# EAGLE schematic piezo-preamp-tickler_V1-01a_two_buffers (EAGLE 8.1.0)

## Sheet 1 of 2
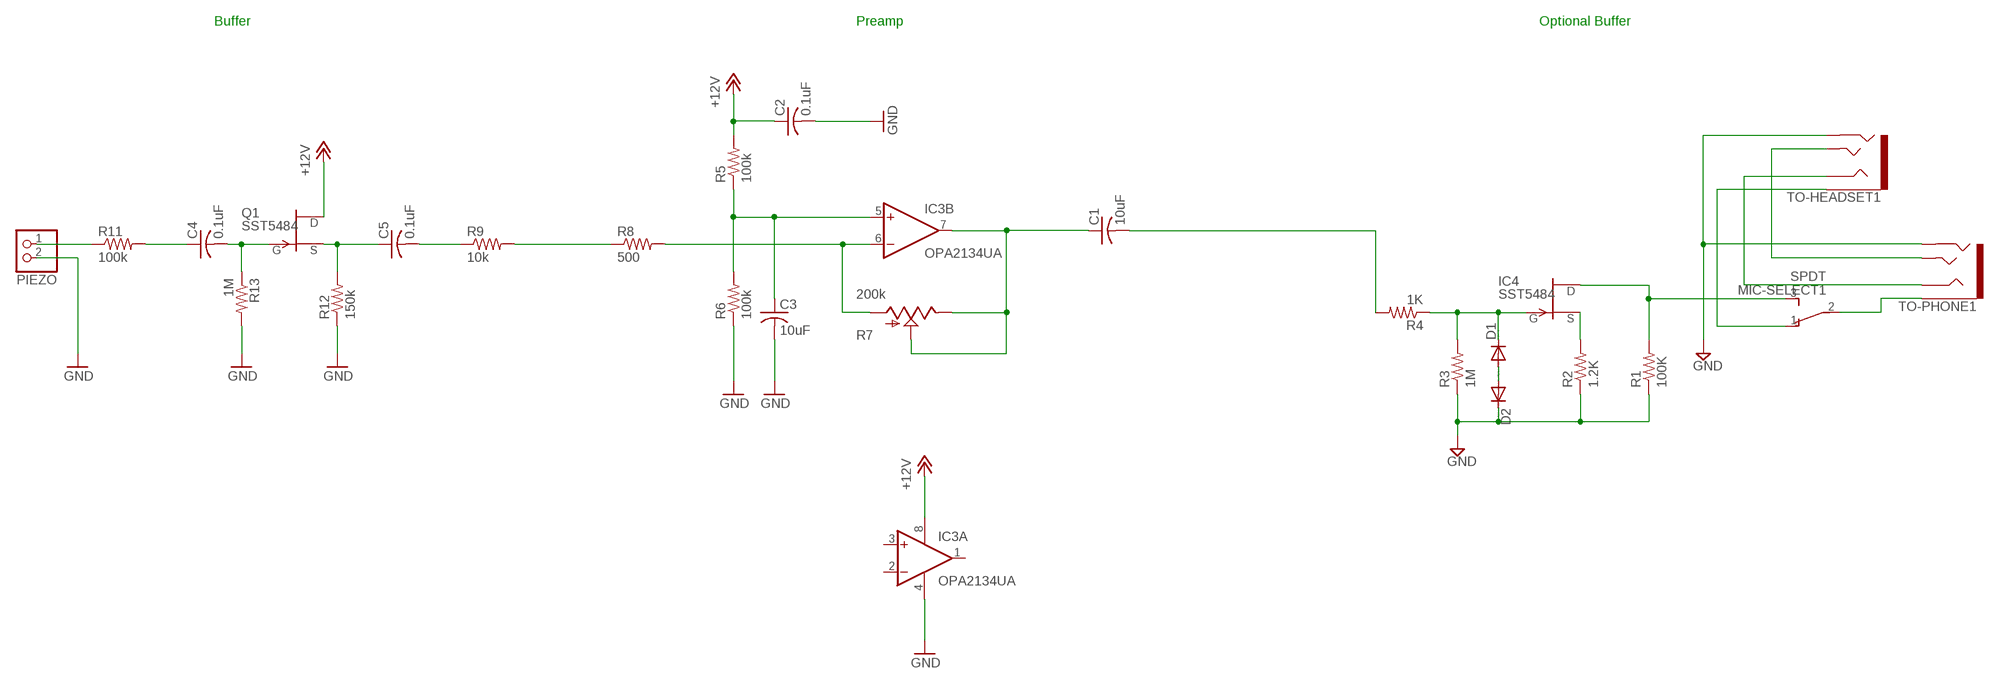
[diagram p0: schematic, sheet 1]

### Parts
C1  10uF  C-USC0805  [C0805]
C2  0.1uF  C-USC0805  [C0805]
C3  10uF  C-USC0805  [C0805]
C4  0.1uF  C-USC0805  [C0805]
C5  0.1uF  C-USC0805  [C0805]
D1  DIODE-SOD123  [SOD123]
D2  DIODE-SOD123  [SOD123]
IC3  OPA2134UA  [SO08]
IC4  SST5484  [SOT23]
MIC-SELECT1  SPDT  SWITCH_SPDTTE-CONNECT  [SWITCH_SPDT-TE-CONNECT]
PIEZO  JST_2PIN-THM  [JST-PH-2-THM]
Q1  SST5484  [SOT23]
R1  100K  R-US_R0603  [R0603]
R2  1.2K  R-US_R0603  [R0603]
R3  1M  R-US_R0603  [R0603]
R4  1K  R-US_R0603  [R0603]
R5  100k  R-US_R0603  [R0603]
R6  100k  R-US_R0603  [R0603]
R7  200k  TRIMPOT-BOURNS3306W  [TRIMPOT-BOURNS-3306W]
R8  500  R-US_R0603  [R0603]
R9  10k  R-US_R0603  [R0603]
R11  100k  R-US_R0603  [R0603]
R12  150k  R-US_R0603  [R0603]
R13  1M  R-US_R0603  [R0603]
TO-HEADSET1  AUDIO-JACK3LGPADS  [AUDIO-JACK-TRRS-SMD]
TO-PHONE1  AUDIO-JACK3LGPADS  [AUDIO-JACK-TRRS-SMD]

### Nets
+12V: C2.1 IC3.8(A:V+) Q1.1(D) R5.2 ; also sheet 2
BUFFER: C5.2 R9.1
GND: C2.2 C3.2 D2.C IC3.4(A:V-) PIEZO.2 R1.1 R2.1 R3.1 R6.1 R12.1 R13.2 TO-HEADSET1.RING2 TO-PHONE1.RING2 ; also sheet 2
N$1: IC4.1(D) MIC-SELECT1.3 R1.2
N$2: PIEZO.1 R11.1
N$3: C1.1 IC3.7(B:OUT) R7.P$2(WIPER) R7.P$3(OUT)
N$4: R8.1 R9.2
N$8: MIC-SELECT1.1 TO-HEADSET1.EARTH
N$16: C4.1 R11.2
N$18: D1.A D2.A
N$19: IC4.2(S) R2.2
N$20: D1.C IC4.3(G) R3.2 R4.1
N$22: C4.2 Q1.3(G) R13.1
N$23: C5.1 Q1.2(S) R12.2
N$25: IC3.6(B:-IN) R7.P$1(IN) R8.2
N$26: C3.1 IC3.5(B:+IN) R5.1 R6.2
N$27: C1.2 R4.2
N$29: TO-HEADSET1.TIP TO-PHONE1.TIP
N$30: TO-HEADSET1.RING1 TO-PHONE1.RING1
N$31: MIC-SELECT1.2 TO-PHONE1.EARTH
Unconnected: IC3.1(A:OUT) IC3.2(A:-IN) IC3.3(A:+IN)

### Notes on the sheet
- Buffer | Preamp | Optional Buffer

## Sheet 2 of 2
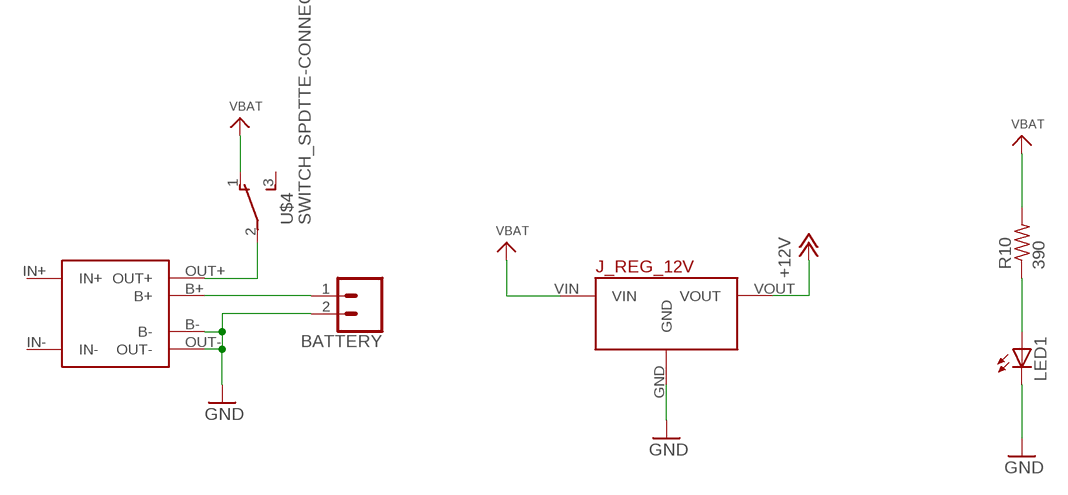
[diagram p1: schematic, sheet 2]

### Parts
BATTERY  CONN_02LOCK  [1X02_LOCK]
J_REG_12V  POLOLU_VOLTAGE_REGULATORS_3PIN  [POLOLU_5V-12V_STEPUP_U3V12F5-U3V12F12]
LED1  LED3MM  [LED3MM]
R10  390  R-US_R0805  [R0805]
U$4  SWITCH_SPDTTE-CONNECT  [SWITCH_SPDT-TE-CONNECT]
U$6  TP4056-MODULE  [TP4056-LITHIUM-PROTECTED-MODULE]

### Nets
+12V: J_REG_12V.VOUT ; also sheet 1
GND: BATTERY.2 J_REG_12V.GND LED1.K(C) U$6.B- U$6.OUT- ; also sheet 1
N$5: U$4.2 U$6.OUT+
N$6: LED1.A R10.1
N$7: BATTERY.1 U$6.B+
VBAT: J_REG_12V.VIN R10.2 U$4.1
Unconnected: U$4.3

## Power pins joined to a net without a drawn wire
IN+: U$6.IN+
IN-: U$6.IN-

## Library data of the parts
BATTERY = SparkFun-Connectors:CONN_02: Multi connection point. Often used as Generic Header-pin footprint for 0.1 inch spaced/style header connections On any of the 0.1 inch spaced packages, you can populate with these: Break Away Headers - Straight <https://www.sparkfun.com/products/116> (PRT-00116) Break Away Male Headers - Right Angle <https://www.sparkfun.com/products/553> (PRT-00553) Female Headers <https://www.sparkfun.com/products/115> (PRT-00115) Break Away Headers - Machine Pin <https://www.sparkfun.com/products/117> (PRT-00117) Break Away Female Headers - Swiss Machine Pin <https://www.sparkfun.com/products/743> (PRT-00743) For SCREWTERMINALS and SPRING TERMINALS visit here: Screw Terimnals on SparkFun.com <https://www.sparkfun.com/search/results?term=Screw+Terminals> (5mm/3.5mm/2.54mm spacing) This device is also useful as a general connection point to wire up your design to another part of your project. Our various solder wires solder well into these plated through hole pads. Hook-Up Wire - Assortment (Stranded, 22 AWG) <https://www.sparkfun.com/products/11375> (PRT-11375) Hook-Up Wire - Assortment (Solid Core, 22 AWG) <https://www.sparkfun.com/products/11367> (PRT-11367) View the entire wire category on our website here <https://www.sparkfun.com/categories/141> Special notes: Molex polarized connector foot print use with: PRT-08233 with associated crimp pins and housings. 2.54_SCREWTERM for use with PRT-10571. 3.5mm Screw Terminal footprints for PRT-08084 5mm Screw Terminal footprints for use with PRT-08432
C1-C5 = adafruit:C-US: CAPACITOR, American symbol
D1 D2 = diode:DIODE-: DIODE
IC3 = linear:OPA2*: Dual Operational Amplifier Low Power, Single-Supply, Rail-To-Rail Operational Amplifier Source: http://focus.ti.com/lit/ds/symlink/opa2345.pdf http://focus.ti.com .. opa241.pdf http://focus.ti.com/lit/ds/symlink/opa2134.pdf
IC4 Q1 = transistor-fet:?548*: N-Channel JFETs Source: VISHAY 2N5484.pdf Compatible: TO92 2N5245 J304 J305 U310 J308 J309 J310 TO72 2N4416 2N4416A 2N3823 2N4351 3N169 3N170 3N171 MFE3002 TO18 2N3796 2N3797 MFE825 Source: Motorola European Master Guide Pacge 3-59
J_REG_12V = CMU-ArtFab:POLOLU_VOLTAGE_REGULATORS_3PIN: Polulu 5V Step-Up/Step-Down Voltage REgulator S7V7F5
LED1 = adafruit:LED: LED OSRAM: - CHIPLED LG R971, LG N971, LY N971, LG Q971, LY Q971, LO R971, LY R971 LH N974, LH R974 LS Q976, LO Q976, LY Q976 LO Q996 - Hyper CHIPLED LW Q18S LB Q993, LB Q99A, LB R99A - SideLED LS A670, LO A670, LY A670, LG A670, LP A670 LB A673, LV A673, LT A673, LW A673 LH A674 LY A675 LS A676, LA A676, LO A676, LY A676, LW A676 LS A679, LY A679, LG A679 - Hyper Micro SIDELED® LS Y876, LA Y876, LO Y876, LY Y876 LT Y87S - SmartLED LW L88C, LW L88S LB L89C, LB L89S, LG L890 LS L89K, LO L89K, LY L89K LS L896, LA L896, LO L896, LY L896 - TOPLED LS T670, LO T670, LY T670, LG T670, LP T670 LSG T670, LSP T670, LSY T670, LOP T670, LYG T670 LG T671, LOG T671, LSG T671 LB T673, LV T673, LT T673, LW T673 LH T674 LS T676, LA T676, LO T676, LY T676, LB T676, LH T676, LSB T676, LW T676 LB T67C, LV T67C, LT T67C, LS T67K, LO T67K, LY T67K, LW E67C LS E67B, LA E67B, LO E67B, LY E67B, LB E67C, LV E67C, LT E67C LW T67C LS T679, LY T679, LG T679 LS T770, LO T770, LY T770, LG T770, LP T770 LB T773, LV T773, LT T773, LW T773 LH T774 LS E675, LA E675, LY E675, LS T675 LS T776, LA T776, LO T776, LY T776, LB T776 LHGB T686 LT T68C, LB T68C - Hyper Mini TOPLED® LB M676 - Mini TOPLED Santana® LG M470 LS M47K, LO M47K, LY M47K Source: http://www.osram.convergy.de/
MIC-SELECT1 U$4 = CMU-ArtFab:SWITCH_SPDT
PIEZO = adafruit:JST_2PIN: JST 2-Pin Connectors of various flavors SMT-RA (S2B-PH-SM4) 4UConnector #17311 SMT (B2B-PH-SM4) THM-RA (S2B-PH) THM (B2B-PH)
R1-R4 = CMU-ArtFab:R-US_: RESISTOR, American symbol
R5 R6 R8 R9 R11-R13 = resistor:R-US_: RESISTOR, American symbol
R7 = CMU-ArtFab:TRIMPOT-BOURNS
R10 = adafruit:R-US_: RESISTOR, American symbol
TO-HEADSET1 TO-PHONE1 = Daniel:AUDIO-JACK3: Audio jack - 3.5mm TRRS variety - two rings.
U$6 = CMU-ArtFab:TP4056-MODULE

## Net classes
0 default: width 0.152 mm, clearance 0.2 mm